# EAGLE design on off switch test (EAGLE 9.1.3)
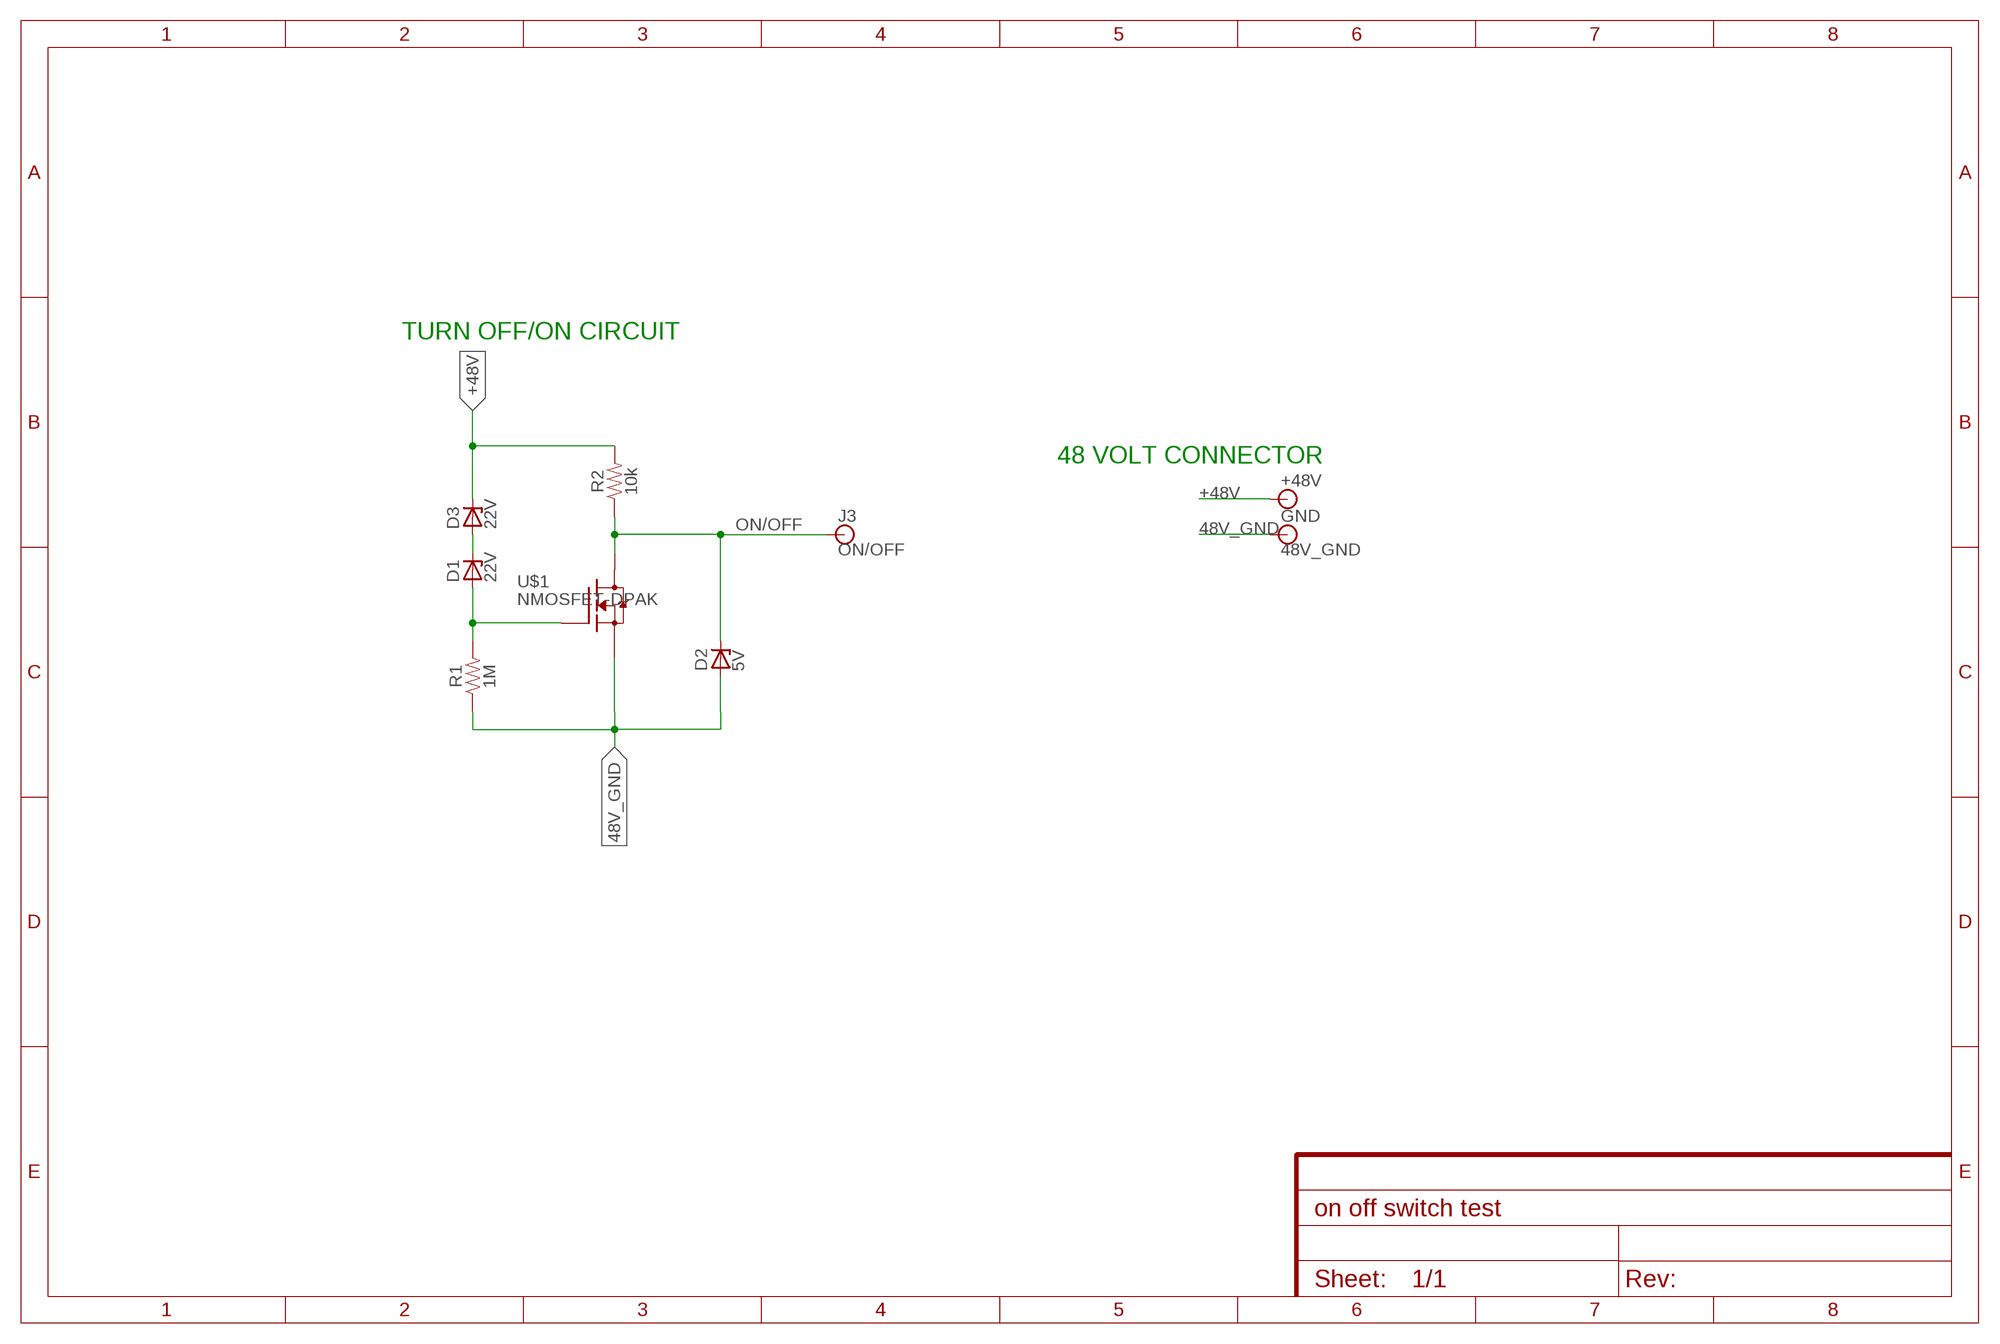
[diagram p0: schematic, sheet 1]

## Parts
+48V  BANANA_CONN  [BANANA_CONN]
D1  22V  ZENER-DIODESOT23  [SOT23]
D2  5V  ZENER-DIODESOT23  [SOT23]
D3  22V  ZENER-DIODESOT23  [SOT23]
GND  48V_GND  BANANA_CONN  [BANANA_CONN]
J3  ON/OFF  BANANA_CONN  [BANANA_CONN]
R1  1M  RESISTOR0603  [0603]
R2  10k  RESISTOR0603  [0603]
U$1  NMOSFET-DPAK  [DPAK]

## Nets
48V_GND: D2.1(A) GND.P$1 R1.1 U$1.3(S)
+48V: +48V.P$1 D3.3(C) R2.2
N$1: D1.3(C) D3.1(A)
N$2: D1.1(A) R1.2 U$1.1(G)
ON/OFF: D2.3(C) J3.P$1 R2.1 U$1.4(D1)

## Notes on the sheet
- TURN OFF/ON CIRCUIT
- 48 VOLT CONNECTOR

## Library data of the parts
+48V GND J3 = SparkFun-Connectors:BANANA_CONN: Through-hole Banana Jack Basic PTH connection for banana jack plugs SparkFun Products: Multimeter Kit <https://www.sparkfun.com/products/retired/10956> Banana to Alligator Cable <https://www.sparkfun.com/products/retired/509> Banana to Alligator Coax Cable <https://www.sparkfun.com/products/retired/508> Banana to Banana Cable <https://www.sparkfun.com/products/retired/507> Banana to IC Hook Cables <https://www.sparkfun.com/products/retired/506>
D1-D3 = diode:ZENER-DIODE: Z-Diode
R1 R2 = SparkFun-Resistors:RESISTOR: Generic Resistor Package; SPICEPREFIX: R
U$1 = MotherboardParts:NMOSFET-DPAK; PN-DIGI: 497-4329-1-ND; VDSS: 60V

## Board
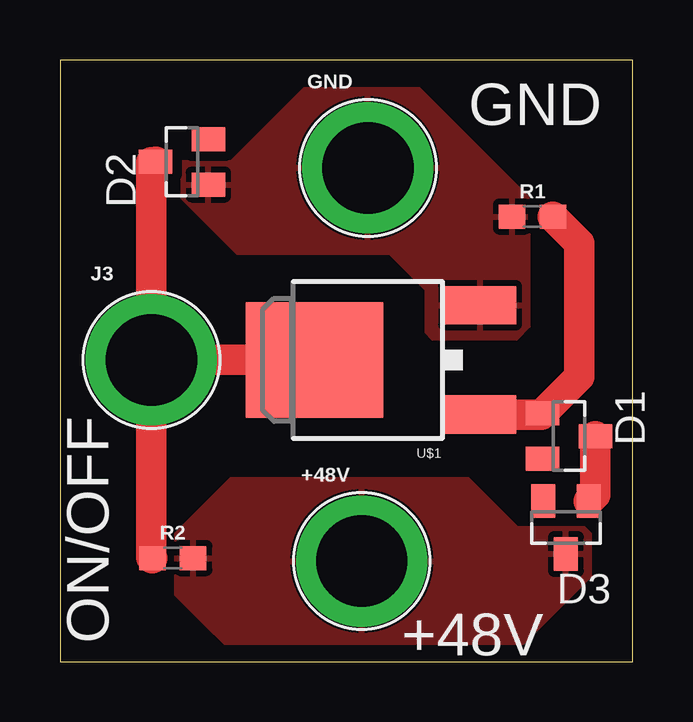
[diagram p1: board, top side]

Size 23.86 x 25.07 mm. Coordinates in mm from the lower left corner, seen from the top.
Outline: 0,0 23.86,0 23.86,25.07 0,25.07 0,0
Copper layers (1*16): Top 0.0356mm / dielectric 1.5011mm / Bottom 0.0356mm
Design rules "ECE_Senior_Design": minimum track width 8mil, minimum drill 13mil, track to track 8mil, track to pad 8mil, pad to pad 6mil, via to via 8mil, smd to smd 6mil, copper to edge 15mil, drill to drill 8mil, minimum pad ring 7mil, minimum via ring 7mil, stop-mask expansion 3mil, vias tented up to drill 0mil, thermal gap 10mil

### Footprints (pad centres in the part's own frame; a part is rotated, then mirrored left to right if it is on the bottom)
BANANA_CONN = drill 3.81 pad 5.461: P$1 0,0
SOT23 = smd 1 x 1.4: 1 -0.95,-1.1; 2 0.95,-1.1; 3 0,1.1
0603 = smd 1.1 x 1: 1 -0.85,0; 2 0.85,0
DPAK = smd 1.6 x 3: 1 -2.28,-5.31; 3 2.28,-5.31 | smd 4.826 x 5.715: 4 0,1.588

### Placement (x,y rotation side)
+48V  12.57,4.19 0 top
D1  21.21,9.4 270 top
D2  5.08,20.83 90 top
D3  21.08,5.59 180 top
GND  12.83,20.57 0 top
J3  3.81,12.57 0 top
R1  19.68,18.54 0 top
R2  4.7,4.32 0 top
U$1  12.19,12.57 90 top

### Tracks (layer width: path | path; a pad name or v marks a point on that pad's centre or on a via)
48V_GND
  pour Top (isolate 0.406): 5.08,20.83 5.08,19.3 7.37,17.02 11.68,17.02 13.72,17.02 15.24,15.49 15.24,13.72 15.49,13.46 16.26,13.46 19.05,13.46 19.56,13.97 19.56,16 19.56,19.3 18.29,20.57 14.99,23.88 12.7,23.88 10.16,23.88 7.37,21.08 7.11,20.83
+48V
  pour Top: 21.08,5.59 21.84,5.59 22.1,5.33 22.1,3.56 19.3,0.76 19.05,0.76 6.86,0.76 6.1,1.52 4.83,2.79 4.83,5.33 7.11,7.62 16.76,7.62 17.02,7.62 19.05,5.59
N$1
  Top 1.27: D1.3 22.31,6.96 D3.1
N$2
  Top 1.27: U$1.1 20.05,10.29 D1.1 21.63,11.87 21.63,17.44 R1.2
ON/OFF
  Top 1.27: D2.3 3.81,20.8 J3.P$1 | U$1.4 J3.P$1 | R2.1 3.81,4.36 J3.P$1

### Text on the board
tNames: GND | ON/OFF | +48V